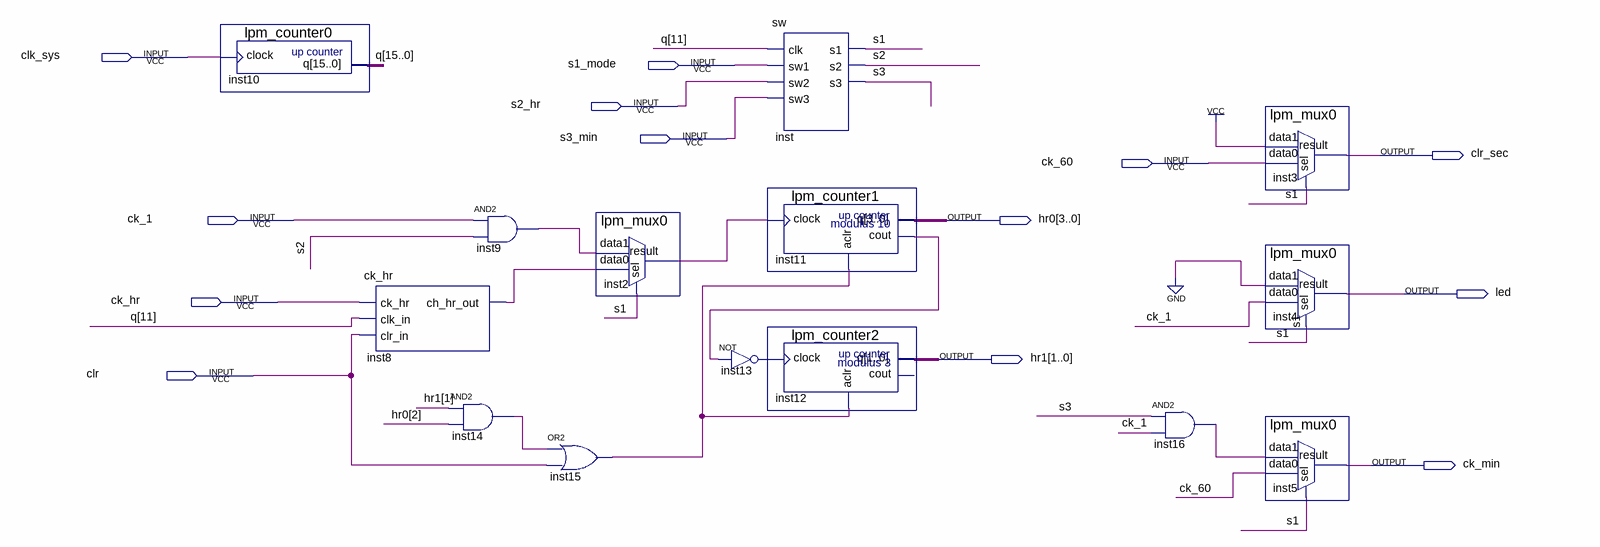
[diagram p0: schematic sheet]
// Quartus schematic Clock.bdf as structural Verilog: 14 symbols, 13 pins
module Clock (
  input  clk_sys,
  input  s1_mode,
  input  s2_hr,
  input  s3_min,
  input  ck_60,
  input  ck_1,
  input  ck_hr,
  input  clr,
  output clr_sec,
  output [3:0] hr0,
  output led,
  output [1:0] hr1,
  output ck_min
);

  wire inst2_result, inst8_ch_hr_out, inst9_out, inst11_cout, inst13_out, inst14_out, inst15_out, inst16_out,
       s1, s2, s3;
  wire [15:0] q;

  lpm_counter0 inst10 (.clock(clk_sys), .q(q));
  ck_hr inst8 (.ck_hr(ck_hr), .clk_in(q[11]), .clr_in(clr), .ch_hr_out(inst8_ch_hr_out));
  and inst14 (inst14_out, hr1[1], hr0[2]);
  and inst9 (inst9_out, ck_1, s2);
  or inst15 (inst15_out, inst14_out, clr);
  lpm_mux0 inst2 (.data1(inst9_out), .data0(inst8_ch_hr_out), .sel(s1), .result(inst2_result));
  sw inst (.clk(q[11]), .sw1(s1_mode), .sw2(s2_hr), .sw3(s3_min), .s1(s1), .s2(s2), .s3(s3));
  lpm_counter1 inst11 (.clock(inst2_result), .aclr(inst15_out), .cout(inst11_cout), .q(hr0));
  lpm_counter2 inst12 (.clock(inst13_out), .aclr(inst15_out), .q(hr1));  // open: cout
  not inst13 (inst13_out, inst11_cout);
  and inst16 (inst16_out, s3, ck_1);
  lpm_mux0 inst3 (.data1(1'b1), .data0(ck_60), .sel(s1), .result(clr_sec));
  lpm_mux0 inst4 (.data1(1'b0), .data0(ck_1), .sel(s1), .result(led));
  lpm_mux0 inst5 (.data1(inst16_out), .data0(ck_60), .sel(s1), .result(ck_min));
endmodule
